# EAGLE schematic Arm Board V3 Arduino (EAGLE 7.0.0)

## Sheet 1 of 7: Power
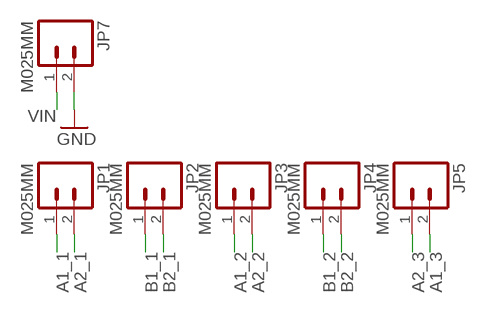
[diagram p0: schematic, sheet 1]

### Parts
JP1  M025MM  [SCREWTERMINAL-5MM-2]
JP2  M025MM  [SCREWTERMINAL-5MM-2]
JP3  M025MM  [SCREWTERMINAL-5MM-2]
JP4  M025MM  [SCREWTERMINAL-5MM-2]
JP5  M025MM  [SCREWTERMINAL-5MM-2]
JP7  M025MM  [SCREWTERMINAL-5MM-2]

### Nets
A1_1: JP1.1 ; also sheet 2
A1_2: JP3.1 ; also sheet 2
A1_3: JP5.2 ; also sheet 2
A2_1: JP1.2 ; also sheet 2
A2_2: JP3.2 ; also sheet 2
A2_3: JP5.1 ; also sheet 2
B1_1: JP2.1 ; also sheet 2
B1_2: JP4.1 ; also sheet 2
B2_1: JP2.2 ; also sheet 2
B2_2: JP4.2 ; also sheet 2
GND: JP7.2 ; also sheet 2,3,4,5,6,7
VIN: JP7.1 ; also sheet 4

## Sheet 2 of 7: Motor Drivers
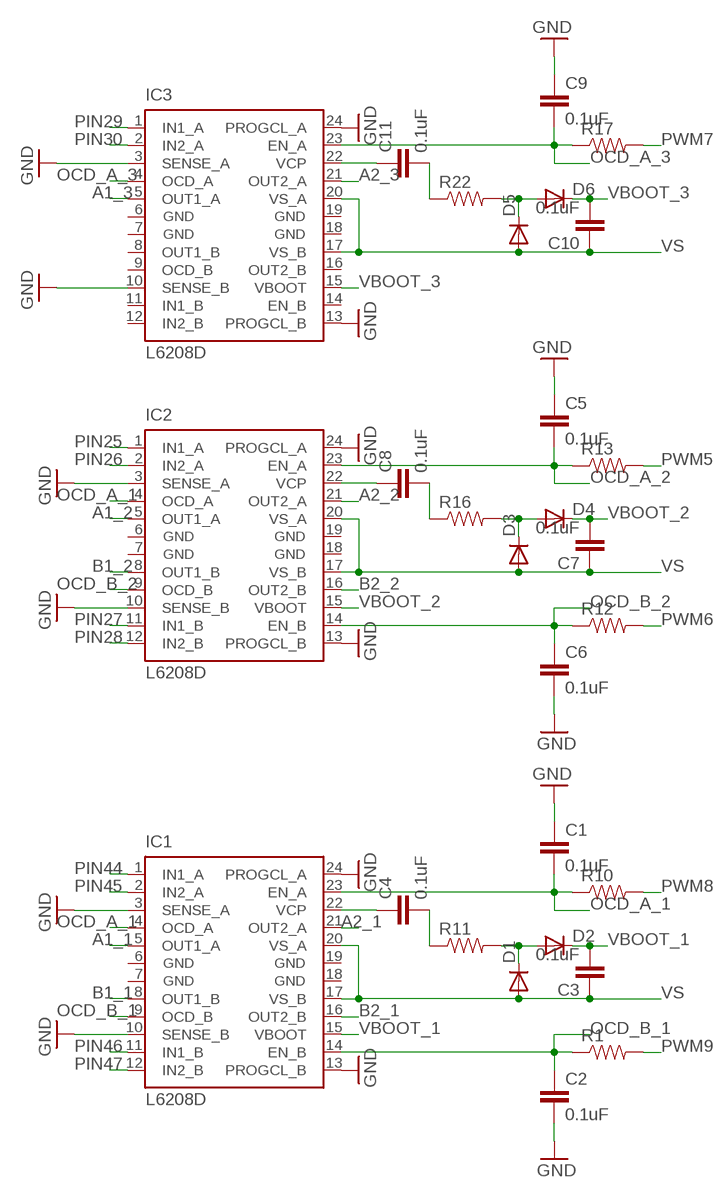
[diagram p1: schematic, sheet 2]

### Parts
C1  0.1uF  0.1UF-25V(+80/-20%)(0603)  [0603-CAP]
C2  0.1uF  0.1UF-25V(+80/-20%)(0603)  [0603-CAP]
C3  0.1uF  0.1UF-25V-5%(0603)  [0603-CAP]
C4  0.1uF  0.1UF-25V-5%(0603)  [0603-CAP]
C5  0.1uF  0.1UF-25V(+80/-20%)(0603)  [0603-CAP]
C6  0.1uF  0.1UF-25V(+80/-20%)(0603)  [0603-CAP]
C7  0.1uF  0.1UF-25V-5%(0603)  [0603-CAP]
C8  0.1uF  0.1UF-25V-5%(0603)  [0603-CAP]
C9  0.1uF  0.1UF-25V(+80/-20%)(0603)  [0603-CAP]
C10  0.1uF  0.1UF-25V-5%(0603)  [0603-CAP]
C11  0.1uF  0.1UF-25V-5%(0603)  [0603-CAP]
D1  DIODE1N4148  [DIODE-1N4148]
D2  DIODE1N4148  [DIODE-1N4148]
D3  DIODE1N4148  [DIODE-1N4148]
D4  DIODE1N4148  [DIODE-1N4148]
D5  DIODE1N4148  [DIODE-1N4148]
D6  DIODE1N4148  [DIODE-1N4148]
IC1  L6208D  [SO24]
IC2  L6208D  [SO24]
IC3  L6208D  [SO24]
R1  RESISTOR0805-RES  [0805]
R10  RESISTOR0805-RES  [0805]
R11  RESISTOR0805-RES  [0805]
R12  RESISTOR0805-RES  [0805]
R13  RESISTOR0805-RES  [0805]
R16  RESISTOR0805-RES  [0805]
R17  RESISTOR0805-RES  [0805]
R22  RESISTOR0805-RES  [0805]

### Nets
A1_1: IC1.5(OUT1_A) ; also sheet 1
A1_2: IC2.5(OUT1_A) ; also sheet 1
A1_3: IC3.5(OUT1_A) ; also sheet 1
A2_1: IC1.21(OUT2_A) ; also sheet 1
A2_2: IC2.21(OUT2_A) ; also sheet 1
A2_3: IC3.21(OUT2_A) ; also sheet 1
B1_1: IC1.8(OUT1_B) ; also sheet 1
B1_2: IC2.8(OUT1_B) ; also sheet 1
B2_1: IC1.16(OUT2_B) ; also sheet 1
B2_2: IC2.16(OUT2_B) ; also sheet 1
GND: C1.1 C2.2 C5.1 C6.2 C9.1 IC1.3(SENSE_A) IC1.10(SENSE_B) IC1.13(PROGCL_B) IC1.24(PROGCL_A) IC2.3(SENSE_A) IC2.10(SENSE_B) IC2.13(PROGCL_B) IC2.24(PROGCL_A) IC3.3(SENSE_A) IC3.10(SENSE_B) IC3.13(PROGCL_B) IC3.24(PROGCL_A) ; also sheet 1,3,4,5,6,7
N$8: D3.C D4.A R16.2
N$9: D1.C D2.A R11.2
N$10: C8.2 R16.1
N$13: C4.1 IC1.22(VCP)
N$15: C4.2 R11.1
N$16: C8.1 IC2.22(VCP)
N$17: D5.C D6.A R22.2
N$18: C11.2 R22.1
N$19: C11.1 IC3.22(VCP)
OCD_A_1: C1.2 IC1.4(OCD_A) IC1.23(EN_A) IC2.4(OCD_A) R10.1
OCD_A_2: C5.2 IC2.23(EN_A) R13.1
OCD_A_3: C9.2 IC3.4(OCD_A) IC3.23(EN_A) R17.1
OCD_B_1: C2.1 IC1.9(OCD_B) IC1.14(EN_B) R1.1
OCD_B_2: C6.1 IC2.9(OCD_B) IC2.14(EN_B) R12.1
PIN25: IC2.1(IN1_A) ; also sheet 4
PIN26: IC2.2(IN2_A) ; also sheet 4
PIN27: IC2.11(IN1_B) ; also sheet 4
PIN28: IC2.12(IN2_B) ; also sheet 4
PIN29: IC3.1(IN1_A) ; also sheet 4
PIN30: IC3.2(IN2_A) ; also sheet 4
PIN44: IC1.1(IN1_A) ; also sheet 4
PIN45: IC1.2(IN2_A) ; also sheet 4
PIN46: IC1.11(IN1_B) ; also sheet 4
PIN47: IC1.12(IN2_B) ; also sheet 4
PWM5: R13.2 ; also sheet 4
PWM6: R12.2 ; also sheet 4
PWM7: R17.2 ; also sheet 4
PWM8: R10.2 ; also sheet 4
PWM9: R1.2 ; also sheet 4
VBOOT_1: C3.2 D2.C IC1.15(VBOOT)
VBOOT_2: C7.2 D4.C IC2.15(VBOOT)
VBOOT_3: C10.2 D6.C IC3.15(VBOOT)
VS: C3.1 C7.1 C10.1 D1.A D3.A D5.A IC1.17(VS_B) IC1.20(VS_A) IC2.17(VS_B) IC2.20(VS_A) IC3.17(VS_B) IC3.20(VS_A)
Unconnected: IC3.8(OUT1_B) IC3.9(OCD_B) IC3.11(IN1_B) IC3.12(IN2_B) IC3.14(EN_B) IC3.16(OUT2_B)

## Sheet 3 of 7: Dynamixel
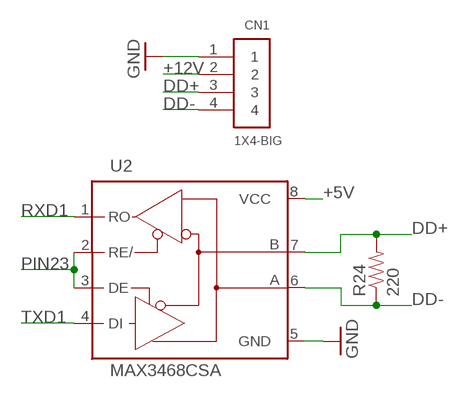
[diagram p2: schematic, sheet 3]

### Parts
CN1  1X4-BIG  [1X04-BIG]
R24  220  RESISTOR0805-RES  [0805]
U2  MAX3468CSA  [SO08]

### Nets
+5V: U2.8(VCC) ; also sheet 4,5,7
+12V: CN1.2
DD+ [USB]: CN1.3 R24.2 U2.7(B)
DD-: CN1.4 R24.1 U2.6(A)
GND: CN1.1 U2.5(GND) ; also sheet 1,2,4,5,6,7
PIN23: U2.2(RE/) U2.3(DE) ; also sheet 4
RXD1: U2.1(RO) ; also sheet 4
TXD1: U2.4(DI) ; also sheet 4

## Sheet 4 of 7: Processor
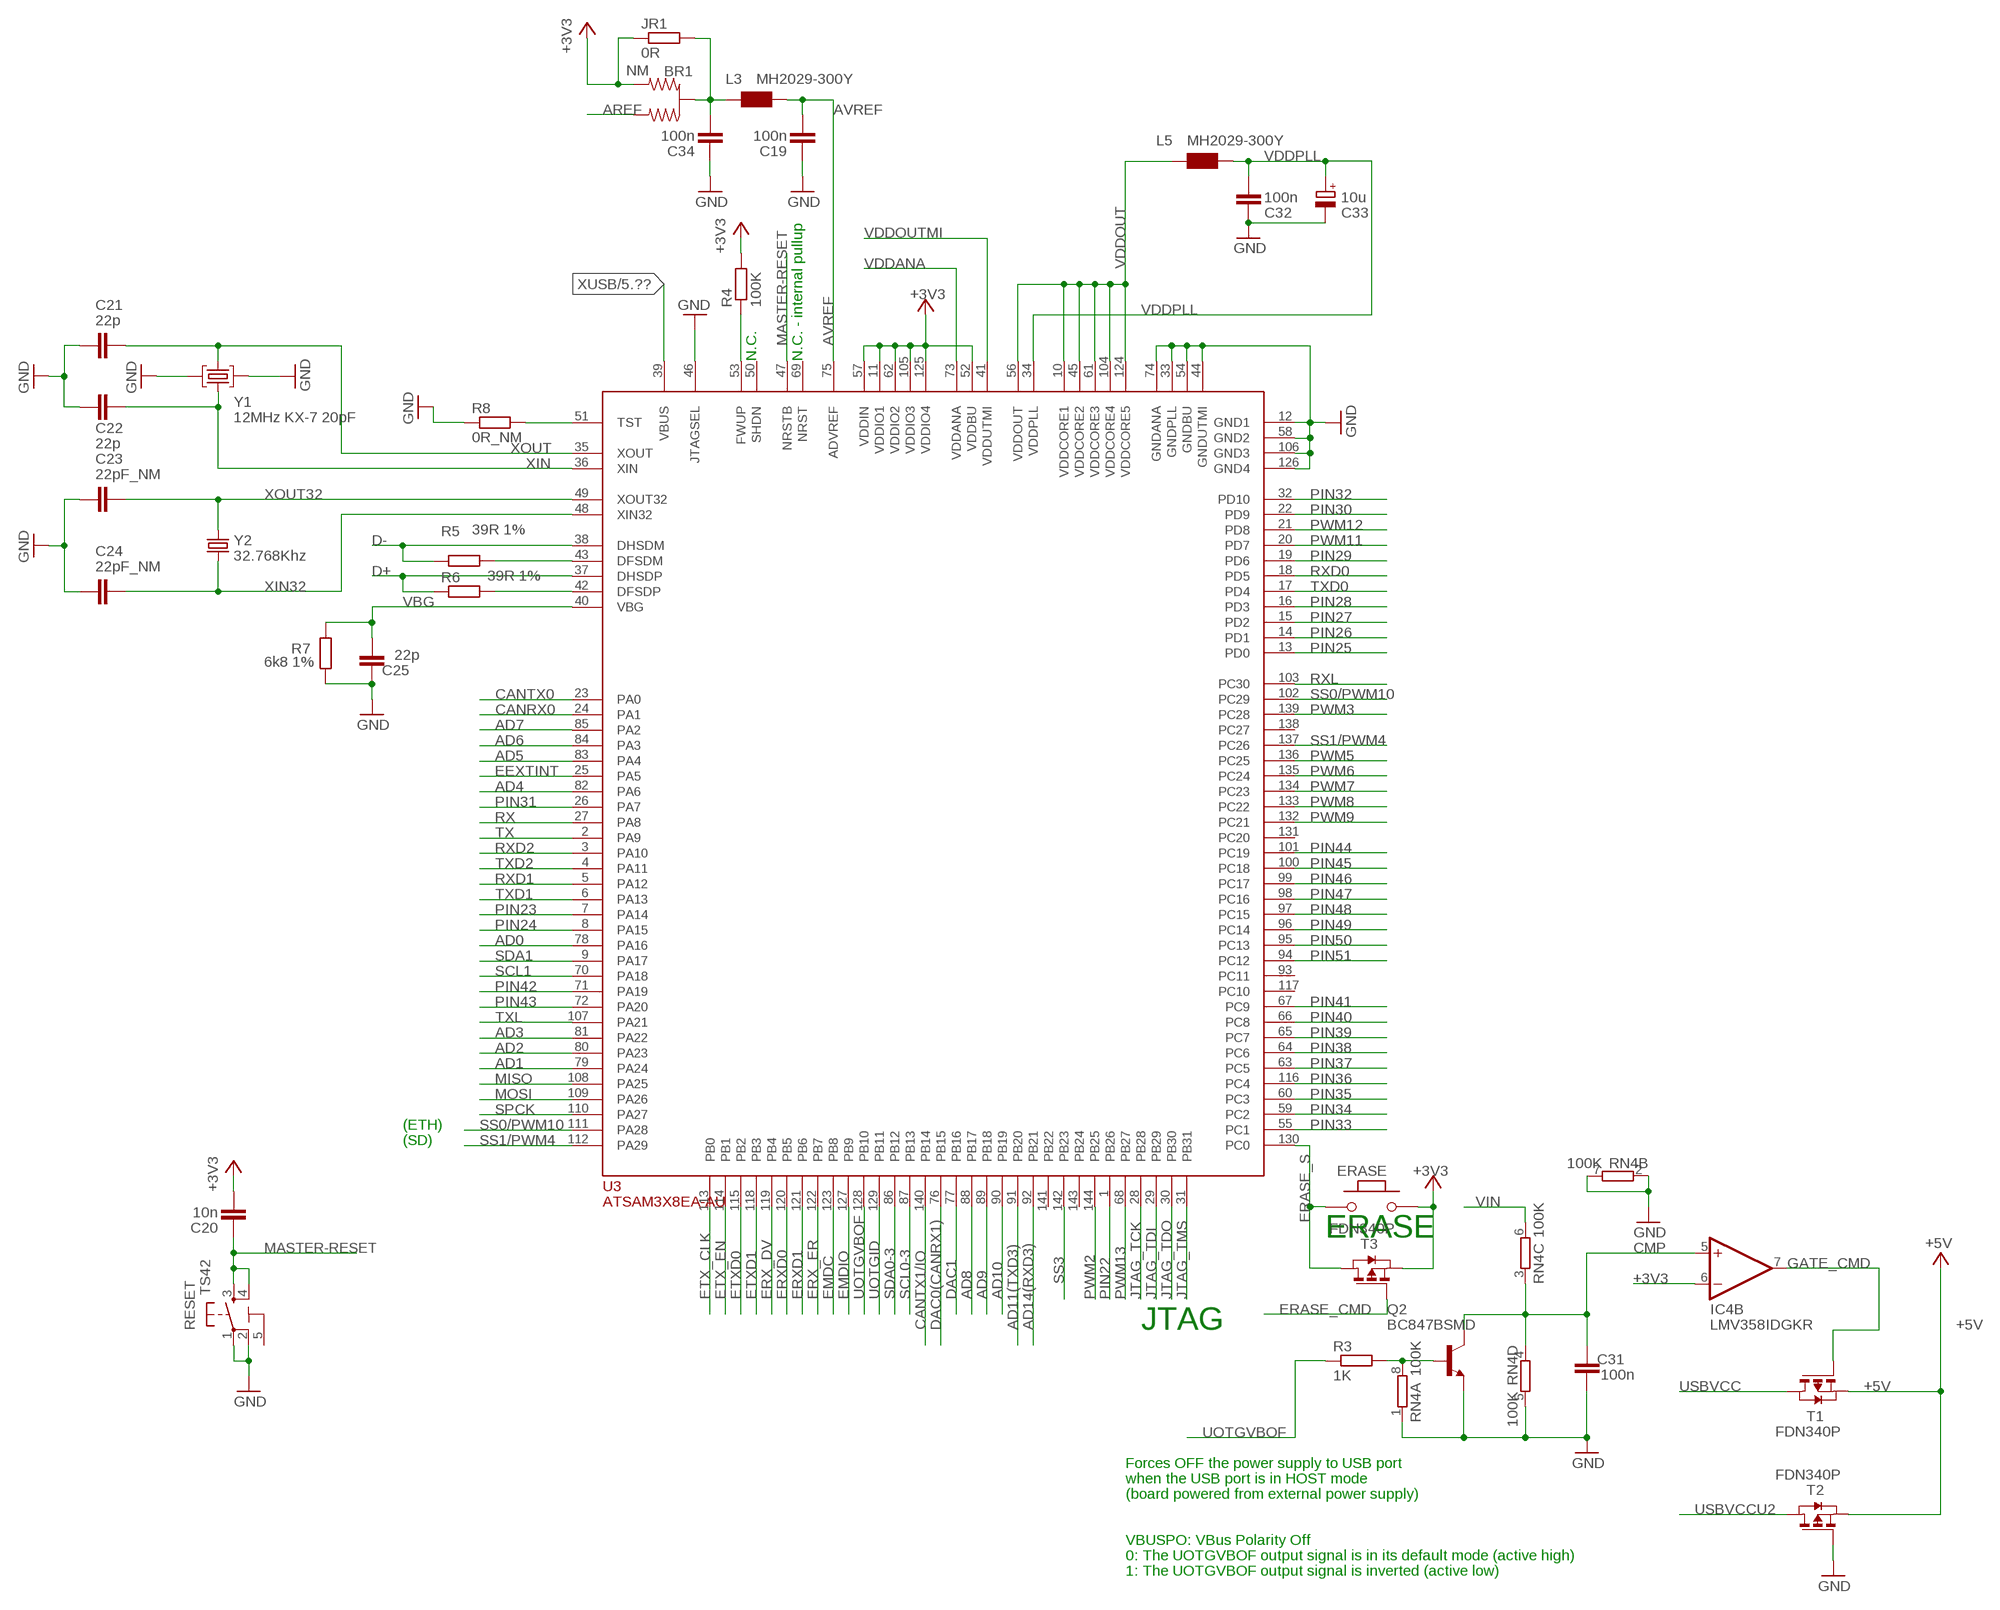
[diagram p3: schematic, sheet 4]

### Parts
BR1  NM  J0402  [J0402]
C19  100n  C-EUC0402  [C0402]
C20  10n  C-EUC0402  [C0402]
C21  22p  C-EUC0402  [C0402]
C22  22p  C-EUC0402  [C0402]
C23  22pF_NM  C-EUC0402  [C0402]
C24  22pF_NM  C-EUC0402  [C0402]
C25  22p  C-EUC0402  [C0402]
C31  100n  C-EUC0402  [C0402]
C32  100n  C-EUC0402  [C0402]
C33  10u  CPOL-EUSMCB  [SMC_B]
C34  100n  C-EUC0402  [C0402]
ERASE  MYSMD_PB157  [SMD_157SW]
IC4  LMV358IDGKR  LMV358MMX  [MSOP08]
JR1  0R  R-EU_R0402  [R0402]
L3  MH2029-300Y  WE-CBF_0805  [0805]
L5  MH2029-300Y  WE-CBF_0805  [0805]
Q2  BC847BSMD  [SOT23]
R3  1K  R-EU_R0402  [R0402]
R4  100K  R-EU_R0402  [R0402]
R5  39R 1%  R-EU_R0402  [R0402]
R6  39R 1%  R-EU_R0402  [R0402]
R7  6k8 1%  R-EU_R0603  [R0603-ROUND]
R8  0R_NM  R-EU_R0402  [R0402]
RESET  TS42  [TS42]
RN4  100K  4R-NCAT16  [CAT16]
T1  FDN340P  PMOSSOT23  [SOT-23]
T2  FDN340P  PMOSSOT23  [SOT-23]
T3  FDN340P  PMOSSOT23  [SOT-23]
U3  ATSAM3X8EA-AU  ATSAM3X/AAU  [LQFP144]
Y1  12MHz KX-7 20pF  CRYSTAL-3.2-2.5  [CRYSTAL-3.2-2.5]
Y2  32.768Khz  RESONATOR_EPSON_FC_145  [RESONATOR_EPSON_FC_145]

### Nets
+3V3: BR1.3 C20.2 ERASE.1 IC4.6(B:-IN) JR1.1 R4.2 T3.2(S) U3.11(VDDIO1) U3.52(VDDBU) U3.57(VDDIN) U3.62(VDDIO2) U3.105(VDDIO3) U3.125(VDDIO4) ; also sheet 5,6
+5V: T1.2(S) T2.2(S) ; also sheet 3,5,7
AD0: U3.78(PA16)
AD1: U3.79(PA24)
AD2: U3.80(PA23)
AD3: U3.81(PA22)
AD4: U3.82(PA6)
AD5: U3.83(PA4)
AD6: U3.84(PA3)
AD7: U3.85(PA2)
AD8: U3.88(PB17)
AD9: U3.89(PB18)
AD10: U3.90(PB19)
AD11(TXD3): U3.91(PB20)
AD14(RXD3): U3.92(PB21)
AREF: BR1.1
AVREF: C19.2 L3.2 U3.75(ADVREF)
AVREFL: BR1.2(C) C34.2 JR1.2 L3.1
CANRX0: U3.24(PA1)
CANTX0: U3.23(PA0)
CANTX1/IO: U3.140(PB14)
CMP: C31.2 IC4.5(B:+IN) Q2.3(C) RN4.3 RN4.4
D+ [USB]: R6.1 U3.37(DHSDP) ; also sheet 5
D- [USB]: R5.1 U3.38(DHSDM) ; also sheet 5
DAC0(CANRX1): U3.76(PB15)
DAC1: U3.77(PB16)
EEXTINT: U3.25(PA5)
EMDC: U3.123(PB8)
EMDIO: U3.127(PB9)
ERASE_CMD: T3.3(G) ; also sheet 5
ERASE_S: ERASE.2 T3.1(D) U3.130(PC0)
ERX_DV: U3.119(PB4)
ERX_ER: U3.122(PB7)
ERXD0: U3.120(PB5)
ERXD1: U3.121(PB6)
ETX_CLK: U3.113(PB0)
ETX_EN: U3.114(PB1)
ETXD0: U3.115(PB2)
ETXD1: U3.118(PB3)
GATE_CMD: IC4.7(B:OUT) T1.3(G)
GND: C19.1 C21.2 C22.2 C23.2 C24.2 C25.2 C31.1 C32.1 C33.- C34.1 Q2.2(E) R7.1 R8.1 RESET.1 RESET.2 RN4.1 RN4.2 RN4.5 RN4.7 T2.3(G) U3.12(GND1) U3.33(GNDPLL) U3.44(GNDUTMI) U3.46(JTAGSEL) U3.54(GNDBU) U3.58(GND2) U3.74(GNDANA) U3.106(GND3) U3.126(GND4) Y1.2(GND) Y1.4(GND) ; also sheet 1,2,3,5,6,7
JTAG_TCK: U3.28(PB28)
JTAG_TDI: U3.29(PB29)
JTAG_TDO: U3.30(PB30)
JTAG_TMS: U3.31(PB31)
MASTER-RESET: C20.1 RESET.3 RESET.4 U3.47(NRSTB) ; also sheet 5
MISO: U3.108(PA25)
MOSI: U3.109(PA26)
N$5: R8.2 U3.51(TST)
N$6: Q2.1(B) R3.2 RN4.8
N$7: R4.1 U3.53(FWUP)
N$11: R5.2 U3.43(DFSDM)
N$12: R6.2 U3.42(DFSDP)
PIN22: U3.1(PB26)
PIN23: U3.7(PA14) ; also sheet 3
PIN24: U3.8(PA15)
PIN25: U3.13(PD0) ; also sheet 2
PIN26: U3.14(PD1) ; also sheet 2
PIN27: U3.15(PD2) ; also sheet 2
PIN28: U3.16(PD3) ; also sheet 2
PIN29: U3.19(PD6) ; also sheet 2
PIN30: U3.22(PD9) ; also sheet 2
PIN31: U3.26(PA7)
PIN32: U3.32(PD10)
PIN33: U3.55(PC1)
PIN34: U3.59(PC2)
PIN35: U3.60(PC3)
PIN36: U3.116(PC4)
PIN37: U3.63(PC5)
PIN38: U3.64(PC6)
PIN39: U3.65(PC7)
PIN40: U3.66(PC8)
PIN41: U3.67(PC9)
PIN42: U3.71(PA19)
PIN43: U3.72(PA20)
PIN44: U3.101(PC19) ; also sheet 2
PIN45: U3.100(PC18) ; also sheet 2
PIN46: U3.99(PC17) ; also sheet 2
PIN47: U3.98(PC16) ; also sheet 2
PIN48: U3.97(PC15)
PIN49: U3.96(PC14)
PIN50: U3.95(PC13)
PIN51: U3.94(PC12)
PWM2: U3.144(PB25)
PWM3: U3.139(PC28)
PWM5: U3.136(PC25) ; also sheet 2
PWM6: U3.135(PC24) ; also sheet 2
PWM7: U3.134(PC23) ; also sheet 2
PWM8: U3.133(PC22) ; also sheet 2
PWM9: U3.132(PC21) ; also sheet 2
PWM11: U3.20(PD7)
PWM12: U3.21(PD8)
PWM13: U3.68(PB27) ; also sheet 6
RX: U3.27(PA8) ; also sheet 5
RXD0: U3.18(PD5)
RXD1: U3.5(PA12) ; also sheet 3
RXD2: U3.3(PA10) ; also sheet 7
RXL: U3.103(PC30) ; also sheet 6
SCL0-3: U3.87(PB13)
SCL1: U3.70(PA18)
SDA0-3: U3.86(PB12)
SDA1: U3.9(PA17)
SPCK: U3.110(PA27)
SS0/PWM10: U3.102(PC29) U3.111(PA28)
SS1/PWM4: U3.112(PA29) U3.137(PC26)
SS3: U3.142(PB23)
TX: U3.2(PA9) ; also sheet 5
TXD0: U3.17(PD4)
TXD1: U3.6(PA13) ; also sheet 3
TXD2: U3.4(PA11) ; also sheet 7
TXL: U3.107(PA21) ; also sheet 6
UOTGID: U3.129(PB11) ; also sheet 5
UOTGVBOF: R3.1 U3.128(PB10)
USBVCC: T1.1(D) ; also sheet 5
USBVCCU2: T2.1(D) ; also sheet 5
VBG: C25.1 R7.2 U3.40(VBG)
VDDANA: U3.73(VDDANA)
VDDOUT: L5.1 U3.10(VDDCORE1) U3.45(VDDCORE2) U3.56(VDDOUT) U3.61(VDDCORE3) U3.104(VDDCORE4) U3.124(VDDCORE5)
VDDOUTMI: U3.41(VDDUTMI)
VDDPLL: C32.2 C33.+ L5.2 U3.34(VDDPLL)
VIN: RN4.6 ; also sheet 1
XIN: C22.1 U3.36(XIN) Y1.1(C1)
XIN32: C24.1 U3.48(XIN32) Y2.P$2
XOUT: C21.1 U3.35(XOUT) Y1.3(C2)
XOUT32: C23.1 U3.49(XOUT32) Y2.P$1
XUSB [usbvcc]: U3.39(VBUS) ; also sheet 5
Unconnected: U3.50(SHDN) U3.69(NRST) U3.93(PC11) U3.117(PC10) U3.131(PC20) U3.138(PC27) U3.141(PB22) U3.143(PB24)

### Notes on the sheet
- N.C. | N.C. - internal pullup
- (ETH)
- (SD)
- ERASE
- JTAG
- Forces OFF the power supply to USB port
- when the USB port is in HOST mode
- (board powered from external power supply)
- VBUSPO: VBus Polarity Off
- 0: The UOTGVBOF output signal is in its default mode (active high)
- 1: The UOTGVBOF output signal is inverted (active low)

## Sheet 5 of 7: USB
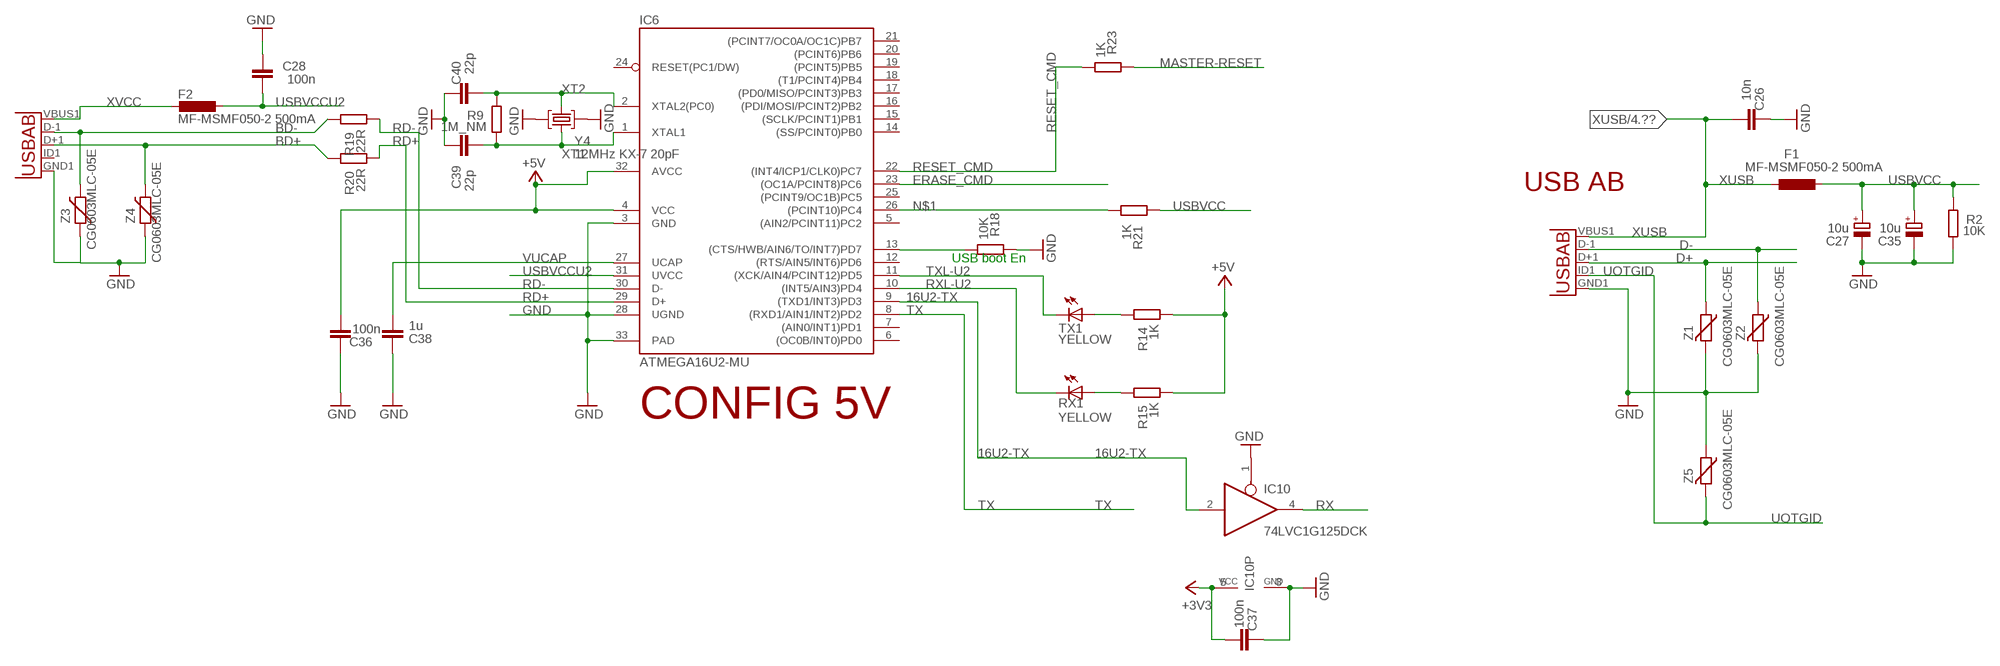
[diagram p4: schematic, sheet 5]

### Parts
C26  10n  C-EUC0402  [C0402]
C27  10u  CPOL-EUSMCB  [SMC_B]
C28  100n  C-EUC0402  [C0402]
C35  10u  CPOL-EUSMCB  [SMC_B]
C36  100n  C-EUC0402  [C0402]
C37  100n  C-EUC0402  [C0402]
C38  1u  C-EUC0402  [C0402]
C39  22p  C-EUC0402  [C0402]
C40  22p  C-EUC0402  [C0402]
F1  MF-MSMF050-2 500mA  L-EUL1812  [L1812]
F2  MF-MSMF050-2 500mA  L-EUL1812  [L1812]
IC6  ATMEGA16U2-MU  [MLF32]
IC10  74LVC1G125DCK  [SC70-5]
R2  10K  R-EU_R0402  [R0402]
R9  1M_NM  R-EU_R0402  [R0402]
R14  1K  R-EU_R0402  [R0402]
R15  1K  R-EU_R0402  [R0402]
R18  10K  R-EU_R0402  [R0402]
R19  22R  R-EU_R0402  [R0402]
R20  22R  R-EU_R0402  [R0402]
R21  1K  R-EU_R0402  [R0402]
R23  1K  0140_1K_0402  [R0402]
RX1  YELLOW  LEDCHIP-LED0805  [CHIP-LED0805]
TX1  YELLOW  LEDCHIP-LED0805  [CHIP-LED0805]
U1  USB-ABCONN-11794  [USB-AB-MICRO-SMD_V03]
U4  USB-ABCONN-11794  [USB-AB-MICRO-SMD_V03]
Y4  12MHz KX-7 20pF  CRYSTAL-3.2-2.5  [CRYSTAL-3.2-2.5]
Z1  CG0603MLC-05E  VARISTORCN0603  [CT/CN0603]
Z2  CG0603MLC-05E  VARISTORCN0603  [CT/CN0603]
Z3  CG0603MLC-05E  VARISTORCN0603  [CT/CN0603]
Z4  CG0603MLC-05E  VARISTORCN0603  [CT/CN0603]
Z5  CG0603MLC-05E  VARISTORCN0603  [CT/CN0603]

### Nets
16U2-TX: IC6.9((TXD1/INT3)PD3) IC10.2(I)
+3V3: C37.1 IC10.5(VCC) ; also sheet 4,6
+5V: C36.1 IC6.4(VCC) IC6.32(AVCC) R14.1 R15.1 ; also sheet 3,4,7
BD+ [USB]: R20.2 U4.D+1(D+) Z4.2
BD- [USB]: R19.2 U4.D-1(D-) Z3.2
D+ [USB]: U1.D+1(D+) Z1.1 ; also sheet 4
D- [USB]: U1.D-1(D-) Z2.1 ; also sheet 4
DTR: IC6.13((CTS/HWB/AIN6/TO/INT7)PD7) R18.1
ERASE_CMD: IC6.23((OC1A/PCINT8)PC6) ; also sheet 4
GND: C26.2 C27.- C28.2 C35.- C36.2 C37.2 C38.2 C39.2 C40.2 IC6.3(GND) IC6.28(UGND) IC6.33(PAD) IC10.1(OE) IC10.3(GND) R2.1 R18.2 U1.GND1(GND) U4.GND1(GND) Y4.2(GND) Y4.4(GND) Z1.2 Z2.2 Z3.1 Z4.1 Z5.1 ; also sheet 1,2,3,4,6,7
MASTER-RESET: R23.2 ; also sheet 4
N$1: IC6.26((PCINT10)PC4) R21.1
N$4: R15.2 RX1.A
N$14: R14.2 TX1.A
RD+: IC6.29(D+) R20.1
RD-: IC6.30(D-) R19.1
RESET_CMD: IC6.22((INT4/ICP1/CLK0)PC7) R23.1
RX: IC10.4(O) ; also sheet 4
RXL-U2: IC6.10((INT5/AIN3)PD4) RX1.C
TX: IC6.8((RXD1/AIN1/INT2)PD2) ; also sheet 4
TXL-U2: IC6.11((XCK/AIN4/PCINT12)PD5) TX1.C
UOTGID: U1.ID1(USBID) Z5.2 ; also sheet 4
USBVCC: C27.+ C35.+ F1.1 R2.2 R21.2 ; also sheet 4
USBVCCU2: C28.1 F2.1 IC6.31(UVCC) ; also sheet 4
VUCAP: C38.1 IC6.27(UCAP)
XT1: C39.1 IC6.1(XTAL1) R9.1 Y4.1(C1)
XT2: C40.1 IC6.2(XTAL2(PC0)) R9.2 Y4.3(C2)
XUSB [usbvcc]: C26.1 F1.2 U1.VBUS1(VBUS) ; also sheet 4
XVCC [usbvcc]: F2.2 U4.VBUS1(VBUS)
Unconnected: IC6.5((AIN2/PCINT11)PC2) IC6.6((OC0B/INT0)PD0) IC6.7((AIN0/INT1)PD1) IC6.12((RTS/AIN5/INT6)PD6) IC6.14((SS/PCINT0)PB0) IC6.15((SCLK/PCINT1)PB1) IC6.16((PDI/MOSI/PCINT2)PB2) IC6.17((PD0/MISO/PCINT3)PB3) IC6.18((T1/PCINT4)PB4) IC6.19((PCINT5)PB5) IC6.20((PCINT6)PB6) IC6.21((PCINT7/OC0A/OC1C)PB7) IC6.24(RESET(PC1/DW)) IC6.25((PCINT9/OC1B)PC5) U4.ID1(USBID)

### Notes on the sheet
- USB AB
- USB boot En
- CONFIG 5V

## Sheet 6 of 7: TX/RX Lights
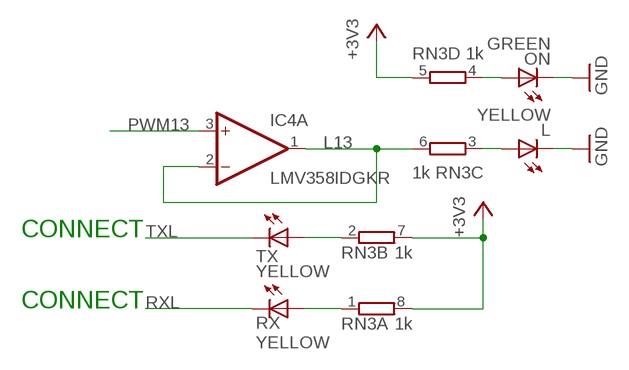
[diagram p5: schematic, sheet 6]

### Parts
L  YELLOW  LEDCHIP-LED0805  [CHIP-LED0805]
ON  GREEN  LEDCHIP-LED0805  [CHIP-LED0805]
RN3  1k  4R-NCAY16  [CAY16]
RX  YELLOW  LEDCHIP-LED0805  [CHIP-LED0805]
TX  YELLOW  LEDCHIP-LED0805  [CHIP-LED0805]

### Nets
+3V3: RN3.5 RN3.7 RN3.8 ; also sheet 4,5
GND: L.C ON.C ; also sheet 1,2,3,4,5,7
L13: IC4.1(A:OUT) IC4.2(A:-IN) RN3.6
N$2: L.A RN3.3
N$3: ON.A RN3.4
N$54: RN3.1 RX.A
N$55: RN3.2 TX.A
PWM13: IC4.3(A:+IN) ; also sheet 4
RXL: RX.C ; also sheet 4
TXL: TX.C ; also sheet 4

### Notes on the sheet
- CONNECT
- CONNECT

## Sheet 7 of 7: Xbee
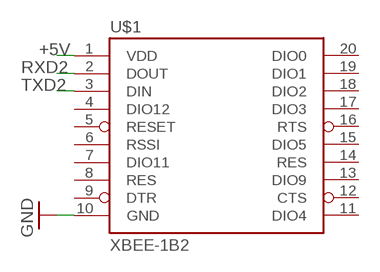
[diagram p6: schematic, sheet 7]

### Parts
U$1  XBEE-1B2  [XBEE-SILK]

### Nets
+5V: U$1.1(VDD) ; also sheet 3,4,5
GND: U$1.10(GND) ; also sheet 1,2,3,4,5,6
RXD2: U$1.2(DOUT) ; also sheet 4
TXD2: U$1.3(DIN) ; also sheet 4
Unconnected: U$1.4(DIO12) U$1.5(RESET) U$1.6(RSSI) U$1.7(DIO11) U$1.8(RES) U$1.9(DTR) U$1.11(DIO4) U$1.12(CTS) U$1.13(DIO9) U$1.14(RES) U$1.15(DIO5) U$1.16(RTS) U$1.17(DIO3) U$1.18(DIO2) U$1.19(DIO1) U$1.20(DIO0)

## Power pins joined to a net without a drawn wire
5-GND: RESET.5(5-GND)
GND: IC1.6(GND) IC1.7(GND) IC1.18(GND) IC1.19(GND) IC2.6(GND) IC2.7(GND) IC2.18(GND) IC2.19(GND) IC3.6(GND) IC3.7(GND) IC3.18(GND) IC3.19(GND)
V+: IC4.8(P:V+)
V-: IC4.4(P:V-)

## Library data of the parts
BR1 = bibaja:J: Three terminal jumper made from two 0402, 0603, 0805, etc.
C1 C2 C5 C6 C9 = SparkFun-Capacitors:0.1UF-25V(+80/-20%)(0603): CAP-00810 Ceramic Standard decoupling cap; PROD_ID: CAP-00810
C3 C4 C7 C8 C10 C11 = SparkFun-Capacitors:0.1UF-25V-5%(0603): CAP-08604; PROD_ID: CAP-08604
C19-C26 C28 C31 C32 C34 C36-C40 = SmartPrj:C-EU: CAPACITOR, European symbol
C27 C33 C35 = rcl:CPOL-EU: POLARIZED CAPACITOR, European symbol
CN1 = adafruit:1X4: 4-pin connector
D1-D6 = SparkFun-DiscreteSemi:DIODE: Diode These are standard reverse protection diodes and small signal diodes. SMA package can handle up to about 1A. SOD-323 can handle about 200mA. What the SOD-323 package when ordering, there are some mfgs out there that are 5-pin packages.
ERASE = SmartPrj:MYSMD_PB157
F1 F2 = rcl:L-EU: INDUCTOR, European symbol
IC1-IC3 = L6206D:L6208: DUAL DMOS FULL BRIDGE MOTOR DRIVER
IC4 = linear:LMV358?*: Dual General Purpose, Low Voltage, Rail-to-Rail Output Operational Amplifiers Source: http://www.national.com/mpf/LM/LMV321.html http://www.national.com/dt/lmv_qual.pdf
IC6 = SmartPrj:ATMEGA16U2-
IC10 = 74xx-little-us:74*1G125: Single Bus Buffer Gate with 3-State Output
JP1-JP5 JP7 = SparkFun-Connectors:M02: Standard 2-pin 0.1" header. Use with - straight break away headers ( PRT-00116) - right angle break away headers (PRT-00553) - swiss pins (PRT-00743) - machine pins (PRT-00117) - female headers (PRT-00115) Molex polarized connector foot print use with: PRT-08233 with associated crimp pins and housings. 2.54_SCREWTERM for use with PRT-10571. 3.5mm Screw Terminal footprints for PRT-08084 5mm Screw Terminal footprints for use with PRT-08433
JR1 R2-R9 R14 R15 R18-R21 = SmartPrj:R-EU_: RESISTOR, European symbol
L ON RX RX1 TX TX1 = led:LED: LED OSRAM: - CHIPLED LG R971, LG N971, LY N971, LG Q971, LY Q971, LO R971, LY R971 LH N974, LH R974 LS Q976, LO Q976, LY Q976 LO Q996 - Hyper CHIPLED LW Q18S LB Q993, LB Q99A, LB R99A - SideLED LS A670, LO A670, LY A670, LG A670, LP A670 LB A673, LV A673, LT A673, LW A673 LH A674 LY A675 LS A676, LA A676, LO A676, LY A676, LW A676 LS A679, LY A679, LG A679 - Hyper Micro SIDELED® LS Y876, LA Y876, LO Y876, LY Y876 LT Y87S - SmartLED LW L88C, LW L88S LB L89C, LB L89S, LG L890 LS L89K, LO L89K, LY L89K LS L896, LA L896, LO L896, LY L896 - TOPLED LS T670, LO T670, LY T670, LG T670, LP T670 LSG T670, LSP T670, LSY T670, LOP T670, LYG T670 LG T671, LOG T671, LSG T671 LB T673, LV T673, LT T673, LW T673 LH T674 LS T676, LA T676, LO T676, LY T676, LB T676, LH T676, LSB T676, LW T676 LB T67C, LV T67C, LT T67C, LS T67K, LO T67K, LY T67K, LW E67C LS E67B, LA E67B, LO E67B, LY E67B, LB E67C, LV E67C, LT E67C LW T67C LS T679, LY T679, LG T679 LS T770, LO T770, LY T770, LG T770, LP T770 LB T773, LV T773, LT T773, LW T773 LH T774 LS E675, LA E675, LY E675, LS T675 LS T776, LA T776, LO T776, LY T776, LB T776 LHGB T686 LT T68C, LB T68C - Hyper Mini TOPLED® LB M676 - Mini TOPLED Santana® LG M470 LS M47K, LO M47K, LY M47K Source: http://www.osram.convergy.de LUXEON: - LUMILED® LXK2-PW12-R00, LXK2-PW12-S00, LXK2-PW14-U00, LXK2-PW14-V00 LXK2-PM12-R00, LXK2-PM12-S00, LXK2-PM14-U00 LXK2-PE12-Q00, LXK2-PE12-R00, LXK2-PE12-S00, LXK2-PE14-T00, LXK2-PE14-U00 LXK2-PB12-K00, LXK2-PB12-L00, LXK2-PB12-M00, LXK2-PB14-N00, LXK2-PB14-P00, LXK2-PB14-Q00 LXK2-PR12-L00, LXK2-PR12-M00, LXK2-PR14-Q00, LXK2-PR14-R00 LXK2-PD12-Q00, LXK2-PD12-R00, LXK2-PD12-S00 LXK2-PH12-R00, LXK2-PH12-S00 LXK2-PL12-P00, LXK2-PL12-Q00, LXK2-PL12-R00 Source: www.luxeon.com KINGBRIGHT: KA-3528ASYC Source: www.kingbright.com
L3 L5 = wuerth-elektronik:WE-CBF: SMD EMI Suppression Ferrite Beads - excellent anti-EMI properties - low DCR - impedances till 3000 ohms - rated current up to 6 A
Q2 = transistor-npn:BC847*: NPN Transistor
R1 R10-R13 R16 R17 R22 R24 = SparkFun-Passives:RESISTOR: Resistor Basic schematic elements and footprints for 0603, 1206, and PTH resistors.
R23 = Resistenze:0140_1K_0402: 1K 0402; CASE: 0402; MONTHLY_USAGE: _____; PART_NUMBER: 1K_0402; PRICE: _____; SUPPLIER: _____; TYPE: Resistenze
RESET = SmartPrj:TS42: TS42 Dongnan Electronics Tact switch VDC 12V - 50mA
RN3 RN4 = resistor-dil:4R-N: Array Chip Resistor Source: RS Component / Phycomp
T1-T3 = zetex:PMOSSOT23: MOS FET
U1 U4 = SparkFun-Connectors:USB-AB: This is a USB AB connector that is compatible with USB OTG. i.e. this connector can serve as a host or device; PROD_ID: CONN-11794
U2 = maxim:MAX34*: +5V, Fail-Safe, 40Mbps, Profibus RS-485/RS-422 Transceivers Source: MAX3465-MAX3469.pdf; MPN: MAX3468CSA+; OC_FARNELL: unknown; OC_NEWARK: 76K6721
U3 = SmartPrj:ATSAM3X/A
U$1 = SparkFun-RF:XBEE-1: Xbee module footprints SMT header is CONN-09042.
Y1 Y4 = SmartPrj:CRYSTAL-3.2-2.5
Y2 = Arduino_Wifi_shield_v018_tG:RESONATOR_EPSON_FC_145
Z1-Z5 = varistor:VARISTOR: VARISTOR

## Net classes
0 default: width 0.203 mm, drill 0.305 mm, clearance 0.203 mm
1 USB: drill 0.406 mm, clearance 0.203 mm to class 0, clearance 0.406 mm
3 usbvcc: width 0.61 mm, drill 0.508 mm, clearance 0.203 mm to class 0, clearance 0.254 mm